# EAGLE design keyboard (EAGLE 7.7.0)

## Sheet 1 of 2
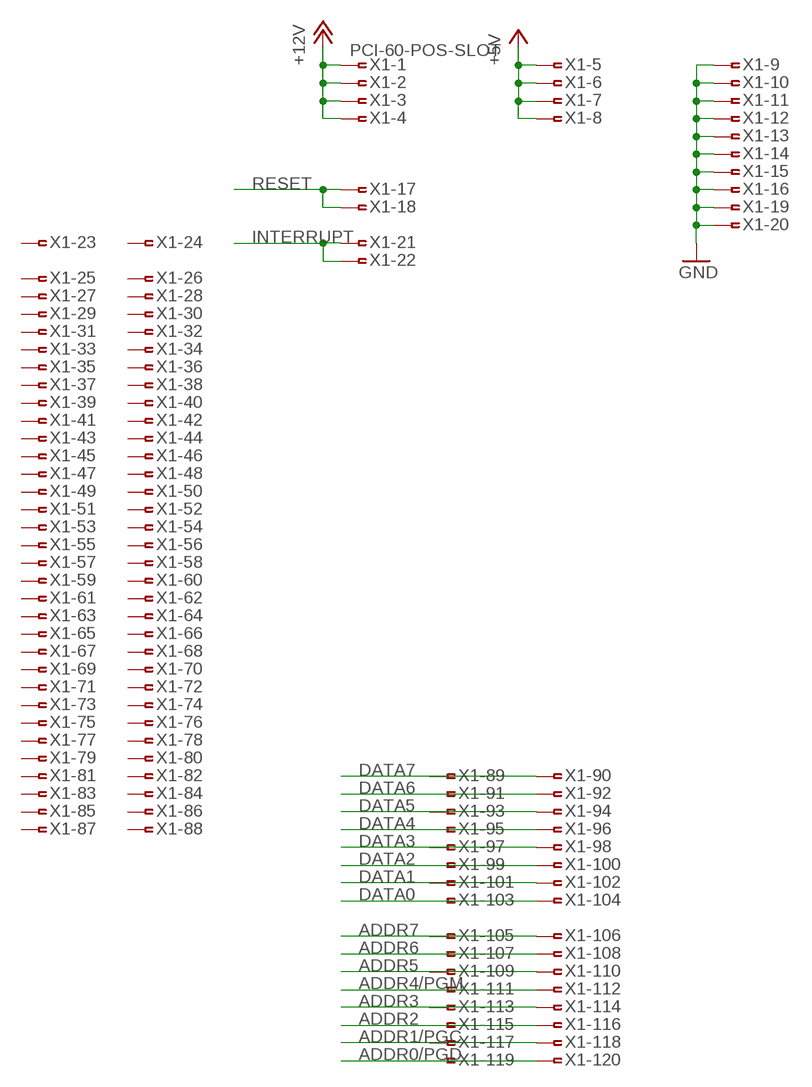
[diagram p0: schematic, sheet 1]

### Parts
X1  PCI-60-POS-SLOT  [PCI-SLOT-60]

### Nets
+5V: X1.5 X1.6 X1.7 X1.8 ; also sheet 2
+12V: X1.1 X1.2 X1.3 X1.4
ADDR0/PGD: X1.119 X1.120 ; also sheet 2
ADDR1/PGC: X1.117 X1.118 ; also sheet 2
ADDR2: X1.115 X1.116 ; also sheet 2
ADDR3: X1.113 X1.114 ; also sheet 2
ADDR4/PGM: X1.111 X1.112 ; also sheet 2
ADDR5: X1.109 X1.110 ; also sheet 2
ADDR6: X1.107 X1.108 ; also sheet 2
ADDR7: X1.105 X1.106 ; also sheet 2
DATA0: X1.103 X1.104 ; also sheet 2
DATA1: X1.101 X1.102 ; also sheet 2
DATA2: X1.99 X1.100 ; also sheet 2
DATA3: X1.97 X1.98 ; also sheet 2
DATA4: X1.95 X1.96 ; also sheet 2
DATA5: X1.93 X1.94 ; also sheet 2
DATA6: X1.91 X1.92 ; also sheet 2
DATA7: X1.89 X1.90 ; also sheet 2
GND: X1.9 X1.10 X1.11 X1.12 X1.13 X1.14 X1.15 X1.16 X1.19 X1.20 ; also sheet 2
INTERRUPT: X1.21 X1.22 ; also sheet 2
RESET: X1.17 X1.18 ; also sheet 2
Unconnected: X1.23 X1.24 X1.25 X1.26 X1.27 X1.28 X1.29 X1.30 X1.31 X1.32 X1.33 X1.34 X1.35 X1.36 X1.37 X1.38 X1.39 X1.40 X1.41 X1.42 X1.43 X1.44 X1.45 X1.46 X1.47 X1.48 X1.49 X1.50 X1.51 X1.52 X1.53 X1.54 X1.55 X1.56 X1.57 X1.58 X1.59 X1.60 X1.61 X1.62 X1.63 X1.64 X1.65 X1.66 X1.67 X1.68 X1.69 X1.70 X1.71 X1.72 X1.73 X1.74 X1.75 X1.76 X1.77 X1.78 X1.79 X1.80 X1.81 X1.82 X1.83 X1.84 X1.85 X1.86 X1.87 X1.88

## Sheet 2 of 2
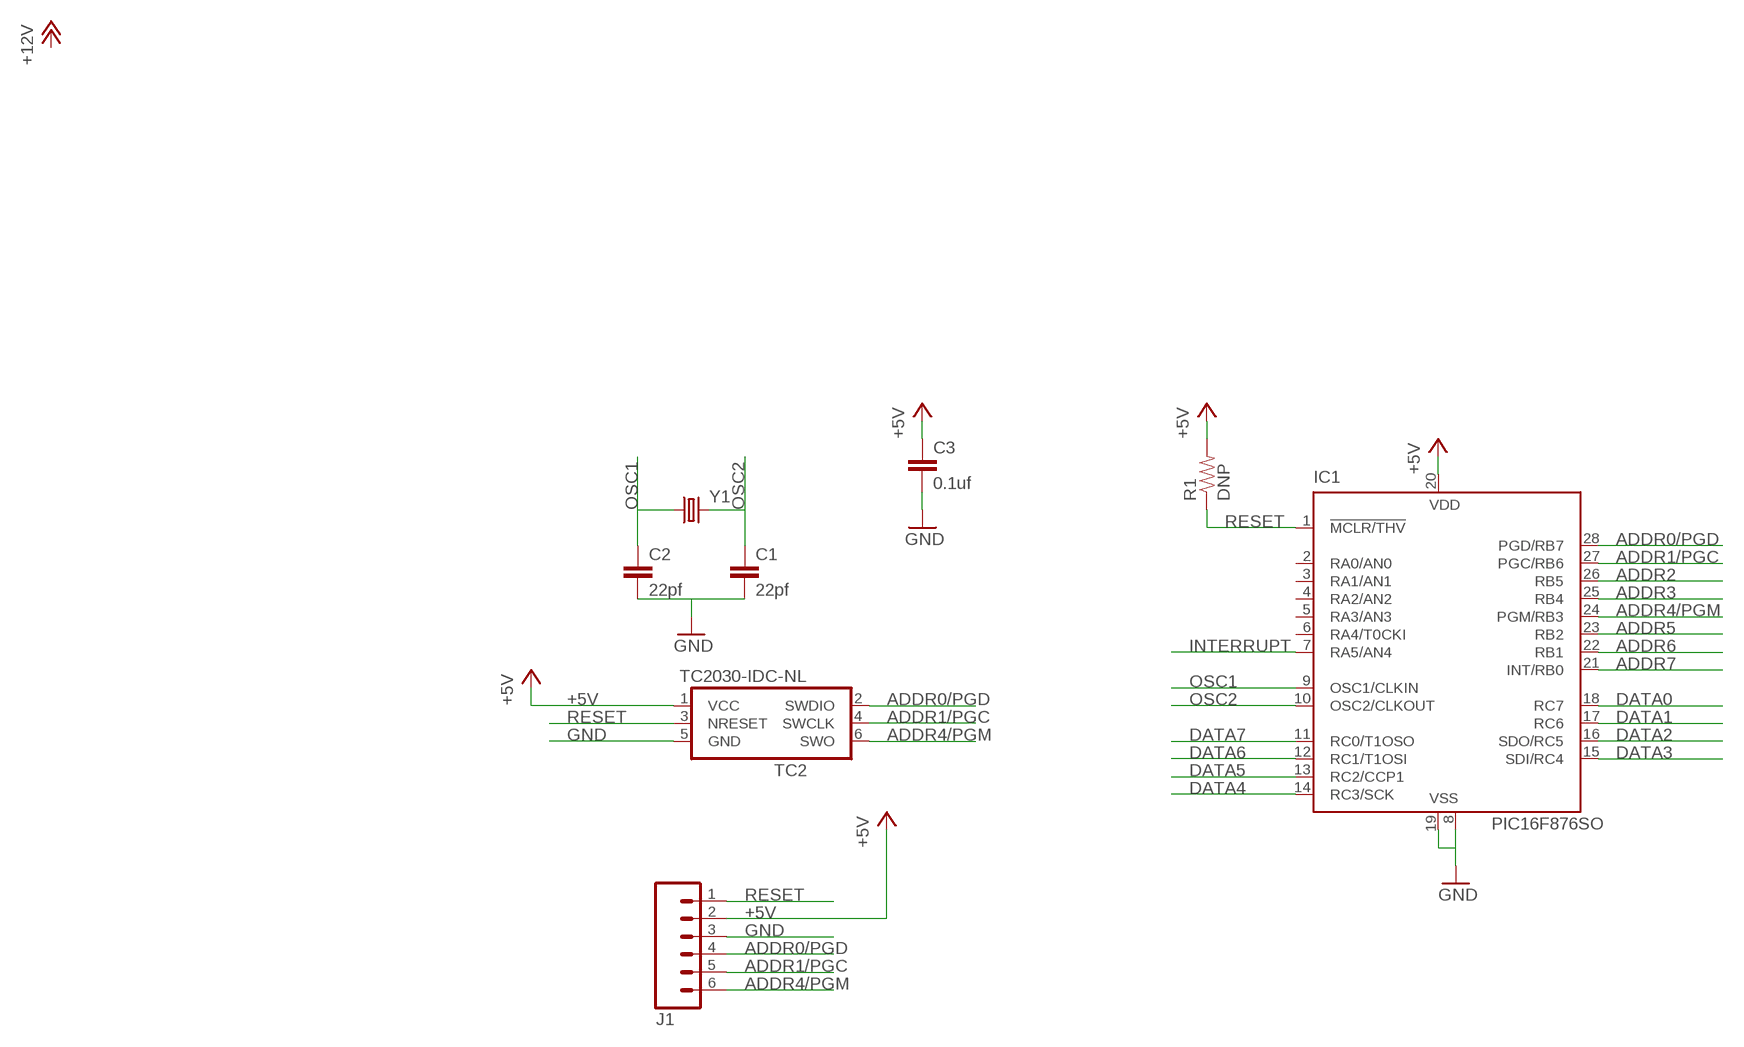
[diagram p1: schematic, sheet 2]

### Parts
C1  22pf  CAP1206  [1206]
C2  22pf  CAP1206  [1206]
C3  0.1uf  CAP1206  [1206]
IC1  PIC16F876SO  [SO28W]
J1  M06POLAR_LOCK  [MOLEX-1X6_LOCK]
R1  DNP  RESISTOR1206  [1206]
TC2  TC2030-IDC-NL  [TC2030-IDC-NL]
Y1  CRYSTALSMD  [HC49UP]

### Nets
+5V: C3.1 IC1.20(VDD) J1.2 R1.2 TC2.1(VCC) ; also sheet 1
ADDR0/PGD: IC1.28(PGD/RB7) J1.4 TC2.2(SWDIO) ; also sheet 1
ADDR1/PGC: IC1.27(PGC/RB6) J1.5 TC2.4(SWCLK) ; also sheet 1
ADDR2: IC1.26(RB5) ; also sheet 1
ADDR3: IC1.25(RB4) ; also sheet 1
ADDR4/PGM: IC1.24(PGM/RB3) J1.6 TC2.6(SWO) ; also sheet 1
ADDR5: IC1.23(RB2) ; also sheet 1
ADDR6: IC1.22(RB1) ; also sheet 1
ADDR7: IC1.21(INT/RB0) ; also sheet 1
DATA0: IC1.18(RC7) ; also sheet 1
DATA1: IC1.17(RC6) ; also sheet 1
DATA2: IC1.16(SDO/RC5) ; also sheet 1
DATA3: IC1.15(SDI/RC4) ; also sheet 1
DATA4: IC1.14(RC3/SCK) ; also sheet 1
DATA5: IC1.13(RC2/CCP1) ; also sheet 1
DATA6: IC1.12(RC1/T1OSI) ; also sheet 1
DATA7: IC1.11(RC0/T1OSO) ; also sheet 1
GND: C1.2 C2.2 C3.2 IC1.8(VSS) IC1.19(VSS) J1.3 TC2.5(GND) ; also sheet 1
INTERRUPT: IC1.7(RA5/AN4) ; also sheet 1
OSC1: C2.1 IC1.9(OSC1/CLKIN) Y1.1
OSC2: C1.1 IC1.10(OSC2/CLKOUT) Y1.2
RESET: IC1.1(!MCLR/THV) J1.1 R1.1 TC2.3(NRESET) ; also sheet 1
Unconnected: IC1.2(RA0/AN0) IC1.3(RA1/AN1) IC1.4(RA2/AN2) IC1.5(RA3/AN3) IC1.6(RA4/T0CKI)

## Library data of the parts
C1-C3 = SparkFun-Capacitors:CAP: Capacitor Standard 0603 ceramic capacitor, and 0.1" leaded capacitor.
IC1 = microchip:PIC16*876: MICROCONTROLLER flash type; MF: MICROCHIP; MPN: PIC16F876-20/SO; OC_FARNELL: 9761268; OC_NEWARK: 12C1950
J1 = SparkFun-Connectors:M06: Header 6 Standard 6-pin 0.1" header. Use with straight break away headers (SKU : PRT-00116), right angle break away headers (PRT-00553), swiss pins (PRT-00743), machine pins (PRT-00117), and female headers (PRT-00115). Molex polarized connector foot print use with SKU : PRT-08094 with associated crimp pins and housings. NOTES ON THE VARIANTS LOCK and LOCK_LONGPADS... This footprint was designed to help hold the alignment of a through-hole component (i.e. 6-pin header) while soldering it into place. You may notice that each hole has been shifted either up or down by 0.005 of an inch from it's more standard position (which is a perfectly straight line). This slight alteration caused the pins (the squares in the middle) to touch the edges of the holes. Because they are alternating, it causes a "brace" to hold the component in place. 0.005 has proven to be the perfect amount of "off-center" position when using our standard breakaway headers. Although looks a little odd when you look at the bare footprint, once you have a header in there, the alteration is very hard to notice. Also,if you push a header all the way into place, it is covered up entirely on the bottom side. This idea of altering the position of holes to aid alignment will be further integrated into the Sparkfun Library for other footprints. It can help hold any component with 3 or more connection pins.
R1 = SparkFun-Resistors:RESISTOR: Resistor Basic schematic elements and footprints for 0603, 1206, and PTH resistors.
TC2 = TagConnect:TC2030-IDC: Tag-Connect In Circuit Programming & Debug Cable 6 Pin http://www.tag-connect.com
X1 = con-amp:PCI-60-POS: PCI-SLOT 60 Dual Position 0.05 Series Standard Edge Source: http://catalog.tycoelectronics.com .. ENG_CD_145167_F.pdf
Y1 = SparkFun-FreqCtrl:CRYSTAL: Various standard crystals. Proven footprints.

## Board
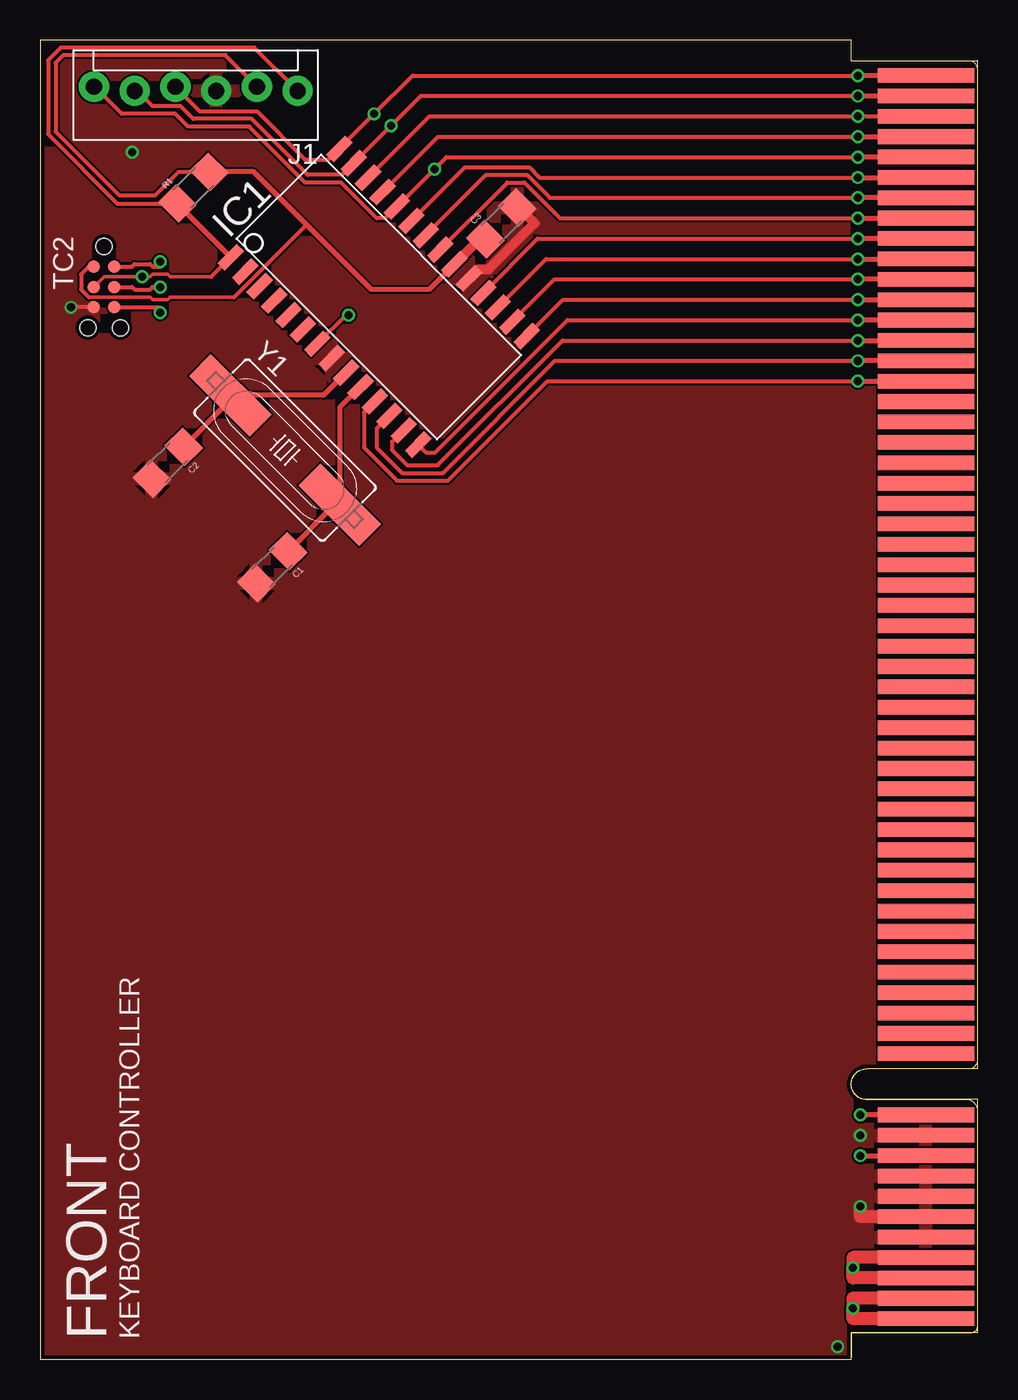
[diagram p2: board, top side]
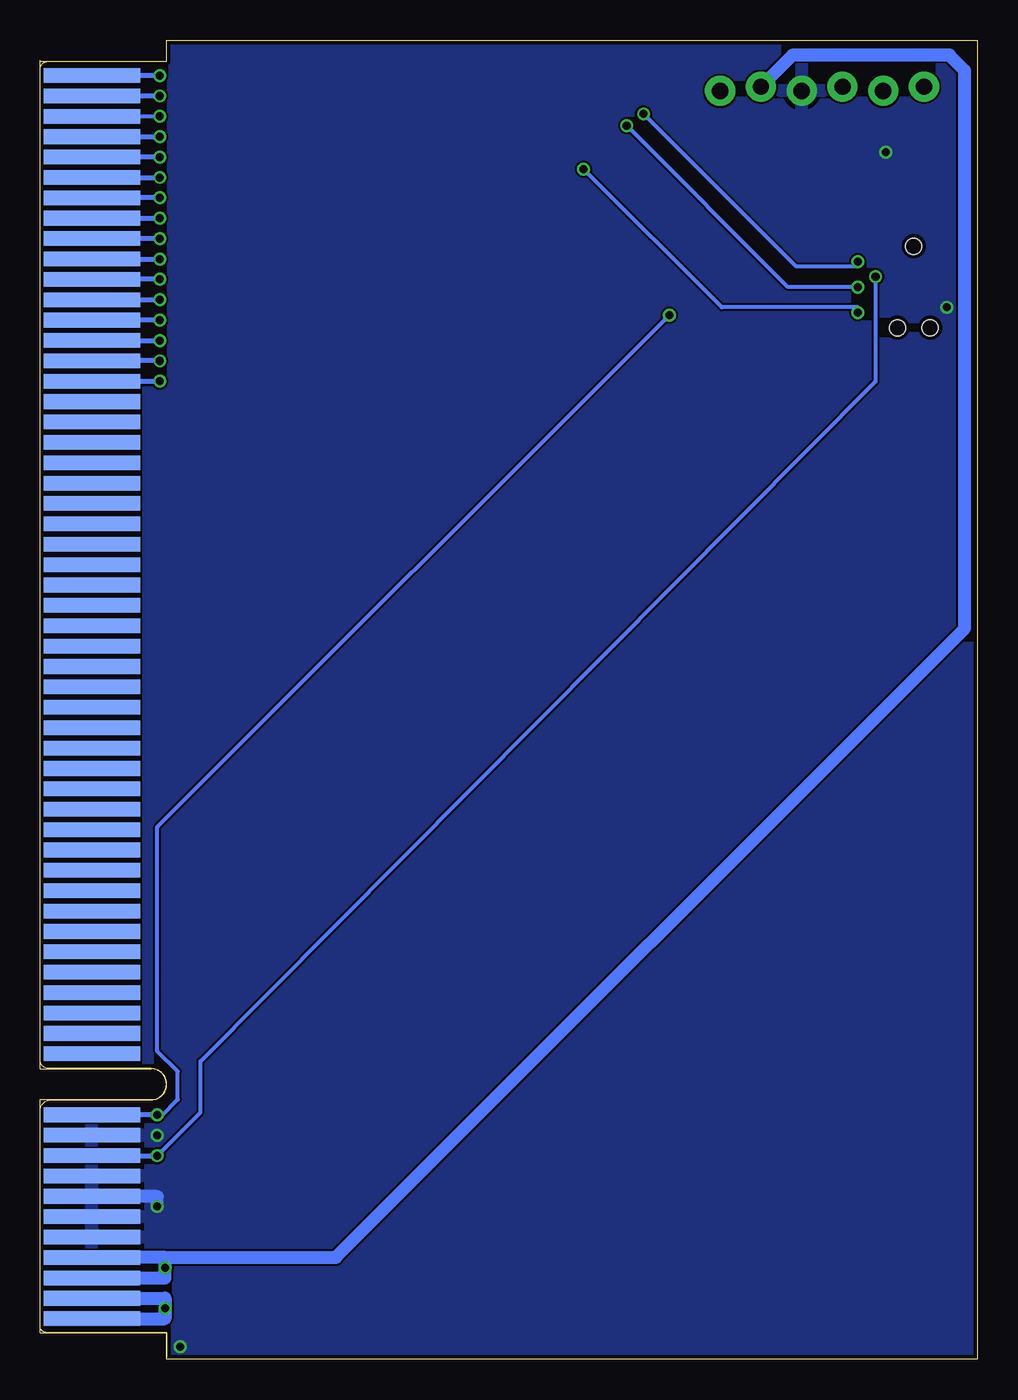
[diagram p3: board, bottom side, seen from below]

Size 58.42 x 82.22 mm. Coordinates in mm from the lower left corner, seen from the top.
Outline: 0,0 50.55,0 50.55,1.67 58.01,1.67 arc90 58.42,2.07 58.42,15.48 arc90 57.73,16.18 51.5,16.18 arc-180 51.5,18.12 57.87,18.12 arc90 58.42,18.68 58.42,80.38 arc90 57.9,80.91 50.55,80.91 50.55,82.22 0,82.22 0,0
Copper layers (1*16): Top 0.035mm / dielectric 1.5mm / Bottom 0.035mm
Design rules "dirtypcbs": minimum track width 5mil, minimum drill 12mil, track to track 5mil, track to pad 5mil, pad to pad 5mil, via to via 5mil, smd to smd 0mil, copper to edge 10mil, drill to drill 10mil, minimum pad ring 10mil, minimum via ring 6mil, stop-mask expansion 2mil, vias tented up to drill 25mil, thermal gap 10mil

### Footprints (pad centres in the part's own frame; a part is rotated, then mirrored left to right if it is on the bottom)
1206 = smd 1.6 x 1.8: 1 -1.4,0; 2 1.4,0
SO28W = smd 0.65 x 1.7: 1 -7.62,-4.78; 2 -6.35,-4.78; 3 -5.08,-4.78; 4 -3.81,-4.78; 5 -2.54,-4.78; 6 -1.27,-4.78; 7 0,-4.78; 8 1.27,-4.78; 9 2.54,-4.78; 10 3.81,-4.78; 11 5.08,-4.78; 12 6.35,-4.78; 13 7.62,-4.78; 14 8.89,-4.78; 15 8.89,4.78; 16 7.62,4.78; 17 6.35,4.78; 18 5.08,4.78; 19 3.81,4.78; 20 2.54,4.78; 21 1.27,4.78; 22 0,4.78; 23 -1.27,4.78; 24 -2.54,4.78; 25 -3.81,4.78; 26 -5.08,4.78; 27 -6.35,4.78; 28 -7.62,4.78
MOLEX-1X6_LOCK = drill 1.016 pad 1.88: 1 0,0; 2 2.54,-0.254; 3 5.08,0; 4 7.62,-0.254; 5 10.16,0; 6 12.7,-0.254
TC2030-IDC-NL = smd 0.787 x 0.787: 1 -1.27,-0.635; 2 -1.27,0.635; 3 0,-0.635; 4 0,0.635; 5 1.27,-0.635; 6 1.27,0.635 | hole 0.991: -2.54,0; 2.54,1.016; 2.54,-1.016
PCI-SLOT-60 = smd 0.91 x 6: 1 0,3.22; 3 1.27,3.22; 5 2.54,3.22; 7 3.81,3.22; 9 5.08,3.22; 11 6.35,3.22; 13 7.62,3.22; 15 8.89,3.22; 17 10.16,3.22; 19 11.43,3.22; 21 12.7,3.22; 23 16.51,3.22; 25 17.78,3.22; 27 19.05,3.22; 29 20.32,3.22; 31 21.59,3.22; 33 22.86,3.22; 35 24.13,3.22; 37 25.4,3.22; 39 26.67,3.22; 41 27.94,3.22; 43 29.21,3.22; 45 30.48,3.22; 47 31.75,3.22; 49 33.02,3.22; 51 34.29,3.22; 53 35.56,3.22; 55 36.83,3.22; 57 38.1,3.22; 59 39.37,3.22; 61 40.64,3.22; 63 41.91,3.22; 65 43.18,3.22; 67 44.45,3.22; 69 45.72,3.22; 71 46.99,3.22; 73 48.26,3.22; 75 49.53,3.22; 77 50.8,3.22; 79 52.07,3.22; 81 53.34,3.22; 83 54.61,3.22; 85 55.88,3.22; 87 57.15,3.22; 89 58.42,3.22; 91 59.69,3.22; 93 60.96,3.22; 95 62.23,3.22; 97 63.5,3.22; 99 64.77,3.22; 101 66.04,3.22; 103 67.31,3.22; 105 68.58,3.22; 107 69.85,3.22; 109 71.12,3.22; 111 72.39,3.22; 113 73.66,3.22; 115 74.93,3.22; 117 76.2,3.22; 119 77.47,3.22 | smd 0.91 x 6 bottom: 2 0,3.22; 4 1.27,3.22; 6 2.54,3.22; 8 3.81,3.22; 10 5.08,3.22; 12 6.35,3.22; 14 7.62,3.22; 16 8.89,3.22; 18 10.16,3.22; 20 11.43,3.22; 22 12.7,3.22; 24 16.51,3.22; 26 17.78,3.22; 28 19.05,3.22; 30 20.32,3.22; 32 21.59,3.22; 34 22.86,3.22; 36 24.13,3.22; 38 25.4,3.22; 40 26.67,3.22; 42 27.94,3.22; 44 29.21,3.22; 46 30.48,3.22; 48 31.75,3.22; 50 33.02,3.22; 52 34.29,3.22; 54 35.56,3.22; 56 36.83,3.22; 58 38.1,3.22; 60 39.37,3.22; 62 40.64,3.22; 64 41.91,3.22; 66 43.18,3.22; 68 44.45,3.22; 70 45.72,3.22; 72 46.99,3.22; 74 48.26,3.22; 76 49.53,3.22; 78 50.8,3.22; 80 52.07,3.22; 82 53.34,3.22; 84 54.61,3.22; 86 55.88,3.22; 88 57.15,3.22; 90 58.42,3.22; 92 59.69,3.22; 94 60.96,3.22; 96 62.23,3.22; 98 63.5,3.22; 100 64.77,3.22; 102 66.04,3.22; 104 67.31,3.22; 106 68.58,3.22; 108 69.85,3.22; 110 71.12,3.22; 112 72.39,3.22; 114 73.66,3.22; 116 74.93,3.22; 118 76.2,3.22; 120 77.47,3.22
HC49UP = smd 5.334 x 1.93: 1 -4.826,0; 2 4.826,0

### Placement (x,y rotation side)
C1  14.45,49.37 225 top
C2  7.94,55.88 225 top
C3  28.73,70.8 45 top
IC1  20.64,66.67 315 top
J1  16.03,79.06 180 top
R1  9.53,73.03 45 top
TC2  3.97,66.83 270 top
X1  58.42,2.54 90 top
Y1  15.24,56.67 315 top

### Tracks (layer width: path | path; a pad name or v marks a point on that pad's centre or on a via)
+5V  (via drill 0.5)
  Top 0.229: 3.02,66.2 6.83,66.2 6.99,66.04 7.94,66.04 8.1,66.2 12.06,66.2
  Top 0.254: J1.2 11.53,81.28 1.43,81.28 0.95,80.8 0.95,76.52 4.92,72.55 7.14,72.55 8.61,74.02 R1.2 | TC2.1 3.02,68.1 2.54,67.63 2.54,66.67 3.02,66.2 | 12.06,66.2 16.59,70.72
  Top 0.305: IC1.20 24.23,66.67 20.64,66.67 16.59,70.72 13.3,74.02 R1.2
  Top 0.61: IC1.20 27.37,69.81 C3.1
  Top 0.813: X1.6 50.64,5.08 v50.64,5.71 50.64,6.35 X1.7
  Bottom 0.813: 50.64,6.35 v50.64,5.71 50.64,5.08 X1.6 | 50.64,6.35 X1.7 | 50.64,6.35 40.01,6.35 0.79,45.56 0.79,80.33 1.75,81.28 11.53,81.28 J1.2
+12V  (via drill 0.5)
  Top 0.813: X1.2 50.64,2.54 v50.64,3.17 50.64,3.81 X1.4
  Bottom 0.813: X1.2 50.64,2.54 50.64,3.02 v50.64,3.17 50.64,3.81 X1.4
ADDR0/PGD  (via drill 0.5)
  Top 0.254: v50.96,80.01 23.2,80.01 v20.81,77.62 IC1.28 18.61,75.44 17.94,74.77 16.51,74.77 13.49,77.79 9.94,77.79 J1.4 | TC2.2 5.71,68.1 5.87,68.26 6.83,68.26 6.99,68.1 7.46,68.1 v7.46,68.42
  Top 0.305: X1.120 v50.96,80.01
  Bottom 0.254: v7.46,68.42 7.46,68.1 11.29,68.1 v20.81,77.62
  Bottom 0.305: v50.96,80.01 X1.120
ADDR1/PGC  (via drill 0.5)
  Top 0.254: v50.96,78.74 23.72,78.74 v21.86,76.88 IC1.27 18.8,73.82 16.67,73.82 13.18,77.31 9.53,77.31 8.73,78.11 6.99,78.11 6.03,79.06 J1.5 | TC2.4 5.71,66.83 5.87,66.67 6.83,66.67 6.99,66.83 v7.46,66.83
  Top 0.305: v50.96,78.74 X1.117
  Bottom 0.254: v7.46,66.83 11.82,66.83 v21.86,76.88
  Bottom 0.305: X1.117 v50.96,78.74
ADDR2  (via drill 0.5)
  Top 0.254: IC1.26 24.25,77.47 v50.96,77.47 X1.116
  Bottom 0.254: X1.116 v50.96,77.47
ADDR3  (via drill 0.5)
  Top 0.254: IC1.25 24.77,76.2 v50.96,76.2
  Top 0.305: v50.96,76.2 X1.113
  Bottom 0.305: X1.113 v50.96,76.2
ADDR4/PGM  (via drill 0.5)
  Top 0.254: v50.96,74.93 25.3,74.93 v24.56,74.19 IC1.24 21.49,71.12 20.95,71.12 18.73,73.34 16.51,73.34 13.02,76.83 9.21,76.83 8.41,77.63 5.08,77.63 3.4,79.31 J1.6 | TC2.6 7.46,65.56 v7.46,65.25
  Top 0.305: X1.112 v50.96,74.93
  Bottom 0.254: v7.46,65.25 7.46,65.56 15.93,65.56 v24.56,74.19
  Bottom 0.305: v50.96,74.93 X1.112
ADDR5  (via drill 0.5)
  Top 0.254: IC1.23 26.46,74.3 30.48,74.3 31.11,73.66 v50.96,73.66
  Top 0.305: v50.96,73.66 X1.109
  Bottom 0.305: X1.109 v50.96,73.66
ADDR6  (via drill 0.5)
  Top 0.254: IC1.22 27.78,73.82 30.32,73.82 31.75,72.39 v50.96,72.39
  Top 0.305: X1.108 v50.96,72.39
  Bottom 0.305: v50.96,72.39 X1.108
ADDR7  (via drill 0.5)
  Top 0.254: IC1.21 29.1,73.34 30.16,73.34 32.38,71.12 v50.96,71.12
  Top 0.305: v50.96,71.12 X1.105
  Bottom 0.305: X1.105 v50.96,71.12
DATA0  (via drill 0.5)
  Top 0.254: IC1.18 31,69.85 v50.96,69.85
  Top 0.305: X1.104 v50.96,69.85
  Bottom 0.305: v50.96,69.85 X1.104
DATA1  (via drill 0.5)
  Top 0.254: IC1.17 31.52,68.58 v50.96,68.58
  Top 0.305: v50.96,68.58 X1.101
  Bottom 0.305: X1.101 v50.96,68.58
DATA2  (via drill 0.5)
  Top 0.254: IC1.16 32.05,67.31 v50.96,67.31
  Top 0.305: X1.100 v50.96,67.31
  Bottom 0.305: v50.96,67.31 X1.100
DATA3  (via drill 0.5)
  Top 0.254: IC1.15 32.58,66.04 v50.96,66.04
  Top 0.305: v50.96,66.04 X1.97
  Bottom 0.305: X1.97 v50.96,66.04
DATA4  (via drill 0.5)
  Top 0.254: IC1.14 24.04,56.52 24.61,56.52 32.86,64.77 v50.96,64.77
  Top 0.305: X1.96 v50.96,64.77
  Bottom 0.305: v50.96,64.77 X1.96
DATA5  (via drill 0.5)
  Top 0.254: IC1.13 21.91,57.17 21.91,56.67 22.86,55.72 24.77,55.72 32.54,63.5 v50.96,63.5
  Top 0.305: v50.96,63.5 X1.93
  Bottom 0.305: X1.93 v50.96,63.5
DATA6  (via drill 0.5)
  Top 0.254: IC1.12 20.95,58.01 20.95,56.83 22.54,55.24 25.08,55.24 32.07,62.23 v50.96,62.23
  Top 0.305: X1.92 v50.96,62.23
  Bottom 0.305: v50.96,62.23 X1.92
DATA7  (via drill 0.5)
  Top 0.254: IC1.11 20.16,59.02 20.16,56.83 22.23,54.77 25.4,54.77 31.59,60.96 v50.96,60.96
  Top 0.305: v50.96,60.96 X1.89
  Bottom 0.305: X1.89 v50.96,60.96
GND  (via drill 0.5)
  Top 0.254: TC2.5 v1.91,65.56
  Top 0.61: IC1.19 27.3,67.94 27.94,67.94 30.8,70.8 29.81,71.79 C3.2
  Top 0.813: X1.12 51.12,8.89 v51.12,9.53
  Bottom 0.813: v51.12,9.53 51.12,10.16 X1.14
  other vias: 5.71,75.25 51.12,13.97 49.69,0.79
  pour Bottom: 0,0 0,82.22 58.42,82.22 58.42,0
  pour Top: 0,82.22 0,0 58.42,0 58.42,82.22
INTERRUPT  (via drill 0.5)
  Top 0.254: v19.21,65.09 19.05,65.09 IC1.7
  Top 0.305: X1.22 v51.12,15.24
  Bottom 0.254: v51.12,15.24 50.8,15.24 49.85,16.19 49.85,17.94 51.12,19.21 51.12,33.18 v19.21,65.09
  Bottom 0.305: v51.12,15.24 X1.22
OSC1
  Top 0.305: C2.1 11.83,59.77 Y1.1 17.64,60.09 IC1.9
OSC2
  Top 0.305: C1.1 18.34,53.26 Y1.2 18.65,59.3 IC1.10
RESET  (via drill 0.5)
  Top 0.229: TC2.3 3.97,67.47 v6.35,67.47 6.83,67.47 6.99,67.63 7.94,67.63 8.1,67.47 10.65,67.47
  Top 0.254: J1.1 13.34,81.76 1.27,81.76 0.48,80.96 0.48,76.36 4.8,72.03 R1.1 | 10.65,67.47 IC1.1
  Top 0.305: v51.12,12.7 X1.18 | IC1.1 8.54,72.02 R1.1
  Bottom 0.254: v51.12,12.7 48.42,15.4 48.42,18.57 6.35,60.96 v6.35,67.47
  Bottom 0.305: X1.18 v51.12,12.7

### Text on the board
tNames: FRONT | KEYBOARD CONTROLLER